# Altium schematic sheet isoSPI Isolation.SchDoc
size A4
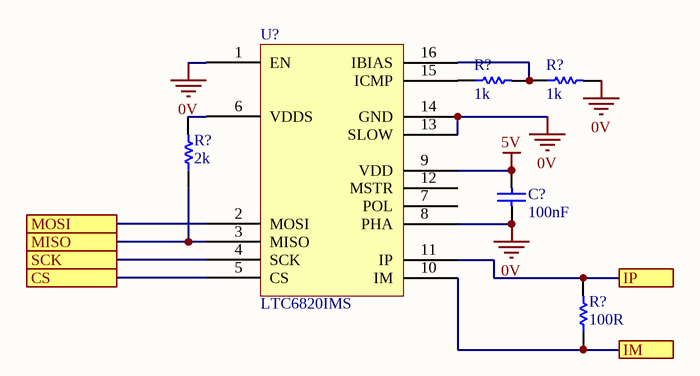
[diagram p0: isoSPI Isolation.SchDoc]

## Parts
(Parts that share a designator on the sheet are numbered #1, #2 ... from top to bottom, then left to right.)
C?  100nF  [0805]
R?#1  1k  [0805]
R?#2  1k  [0805]
R?#3  2k  [0805]
R?#4  100R  [0805]
U?  LTC6820IMS  [LT 16-MSOP]

## Ports
CS, IM, IP, MISO, MOSI, SCK

## Nets
0V: C?.1 R?#2.2 U?.1(EN) U?.8(PHA) U?.13(SLOW) U?.14(GND)
5V: C?.2 U?.9(VDD)
CS: U?.5(CS) ; port CS
IM: R?#4.1 U?.10(IM) ; port IM
IP: R?#4.2 U?.11(IP) ; port IP
MISO: R?#3.1 U?.3(MISO) ; port MISO
MOSI: U?.2(MOSI) ; port MOSI
SCK: U?.4(SCK) ; port SCK
NetR?#1_1: R?#1.1 U?.15(ICMP)
NetR?#1_2: R?#1.2 R?#2.1 U?.16(IBIAS)
NetR?#3_2: R?#3.2 U?.6(VDDS)

Not connected (* = marked no-connect by the designer): U? 7(POL) 12(MSTR)

## Library data of the parts
C? = GCM21BR71E104KA37L: Manufacturer: muRata; Tolerance: 10%; Material: X7R; Rated Voltage: 25V; Part Number: GCM21BR71E104KA37L; Value: 100nF
R?#1 R?#2 = RC0805FR071KL: Manufacturer: YAGEO; Tolerance: 0.01; Rated Voltage: 0.125W; Part Number: RC0805FR071KL; Value: 1k; Material: FR-07
R?#3 = RC0805FR072KL: Manufacturer: YAGEO; Tolerance: 0.01; Rated Voltage: 0.125W; Part Number: RC0805FR072KL; Value: 2k; Material: FR-07
R?#4 = RC0805FR07100RL: Manufacturer: YAGEO; Tolerance: 0.01; Rated Voltage: 0.125W; Part Number: RC0805FR07100RL; Value: 100R; Material: FR-07
U? = LTC6820IMS: Isolated Communications Interface Interface 16-MSOP; Manufacturer: Analog Devices; Part Number: LTC6820IMS; Digikey Part Number: LTC6820IMS#TRPBFCT-ND; Digikey Link: https://www.digikey.com/product-detail/en/linear-technology-analog-devices/LTC6820IMS-TRPBF/LTC6820IMS-TRPBFCT-ND/8322021